# Altium schematic sheet CAN_transciever.SchDoc
size A4; SheetNumber: 6; SheetTotal: 8
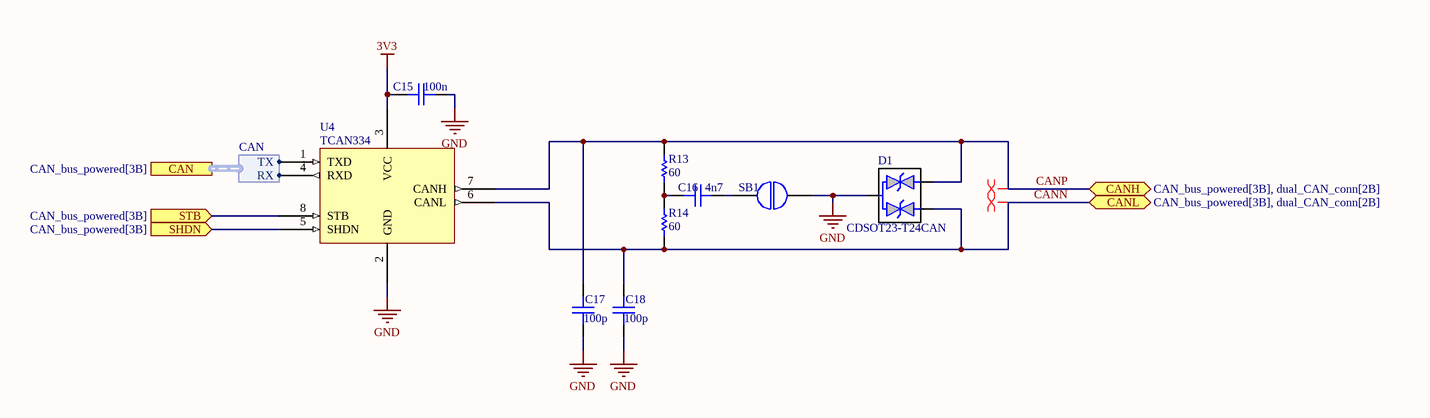
[diagram p0: CAN_transciever.SchDoc]

## Parts
C15  100n
C16  4n7
C17  100p
C18  100p
D1  CDSOT23-T24CAN
R13  60
R14  60
SB1  NO Solder Bridge  (value not drawn)
U4  TCAN334

## Ports
CAN (harness CAN, see CAN_bus_powered[3B]), CANH (bidir, see CAN_bus_powered[3B], dual_CAN_conn[2B]), CANL (bidir, see CAN_bus_powered[3B], dual_CAN_conn[2B]), SHDN (in, see CAN_bus_powered[3B]), STB (in, see CAN_bus_powered[3B])

## Harnesses
CAN: TX, RX

## Nets
3V3: C15.2 U4.3(VCC)
GND: C15.1 C17.2 C18.2 D1.3 SB1.1 U4.2(GND)
CANN: C18.1 D1.1 R14.2 U4.6(CANL) ; port CANL
CANP: C17.1 D1.2 R13.1 U4.7(CANH) ; port CANH
SHDN: U4.5(SHDN) ; port SHDN
STB: U4.8(STB) ; port STB
NetC16_1: C16.1 SB1.2
NetC16_2: C16.2 R13.2 R14.1
NetU4_1: U4.1(TXD) ; port CAN.TX
NetU4_4: U4.4(RXD) ; port CAN.RX

## Layout directives
differential pair: CANN, CANP

## Library data of the parts
C15-C18 = Capacitor
D1 = Dual TVS Diode
R13 R14 = Resistor
SB1 = NO Solder Bridge: Normally Open Solder Bridge
U4 = TCAN334: Can tranciever with shutdown and standby with wake